# EAGLE design Crutch_Light_v1p01 (EAGLE 9.6.2)
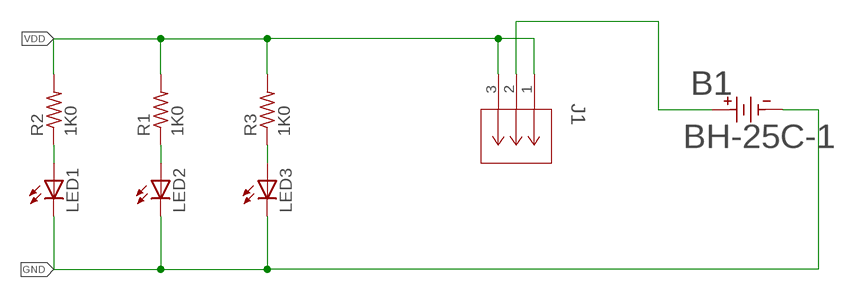
[diagram p0: schematic, sheet 1]

## Parts
B1  BH-25C-1  [BH-25C-1_ADM]
J1  CONN_530470310_PICOBLADE_X_3  [CON_530470310_MOL]
LED1  Green  LED_0805_GREEN  [0805]
LED2  Green  LED_0805_GREEN  [0805]
LED3  Green  LED_0805_GREEN  [0805]
R1  1K0  R_0402_1K0  [0402]
R2  1K0  R_0402_1K0  [0402]
R3  1K0  R_0402_1K0  [0402]

## Nets
GND: B1.1 LED1.2(C) LED2.2(C) LED3.2(C)
N$1: LED1.1(A) R2.P$1
N$2: LED2.1(A) R1.P$1
N$3: LED3.1(A) R3.P$1
N$4: B1.2 J1.2
VDD: J1.1 J1.3 R1.P$2 R2.P$2 R3.P$2

## Library data of the parts
B1 = 3D_MIG_Controller:BH-25C-1; COPYRIGHT: Copyright (C) 2023 Ultra Librarian. All rights reserved.; DIGIKEY_PART_NUMBER_1: 2057-BH-25C-1-ND; MANUFACTURER_PART_NUMBER: BH-25C-1; MFR_NAME: ADAM TECHNOLOGIES INC
J1 = 3D_MIG_Controller:CONN_530470310_PICOBLADE_X_3; COPYRIGHT: Copyright (C) 2022 Ultra Librarian. All rights reserved.; MFR_NAME: Molex Connector Corporation; PARTNO: 530470310
LED1-LED3 = 3D_MIG_Controller:LED_0805_GREEN: Green 570nm LED Indication - Discrete 2.2V 0805 (2012 Metric); PARTNO: LG R971-KN-1
R1-R3 = 3D_MIG_Controller:R_0402_1K0; PARTNO: CRG0402J1K0

## Board
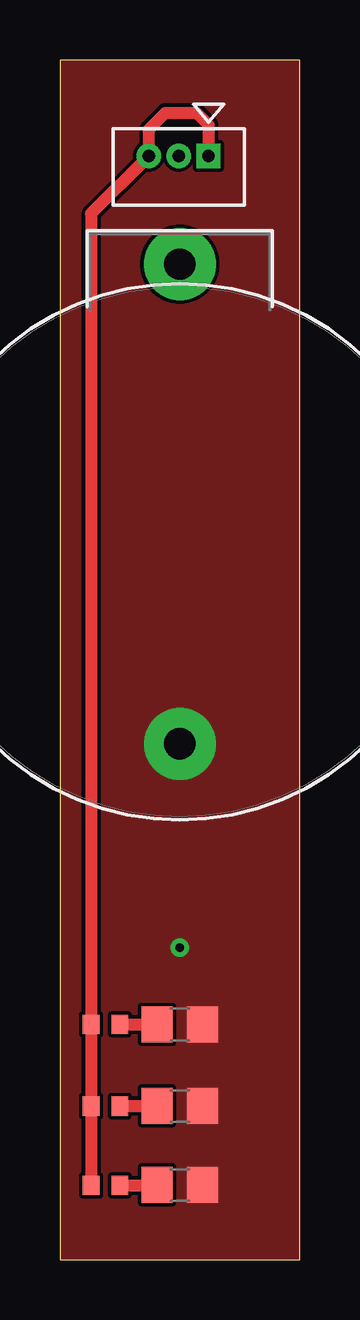
[diagram p1: board, top side]
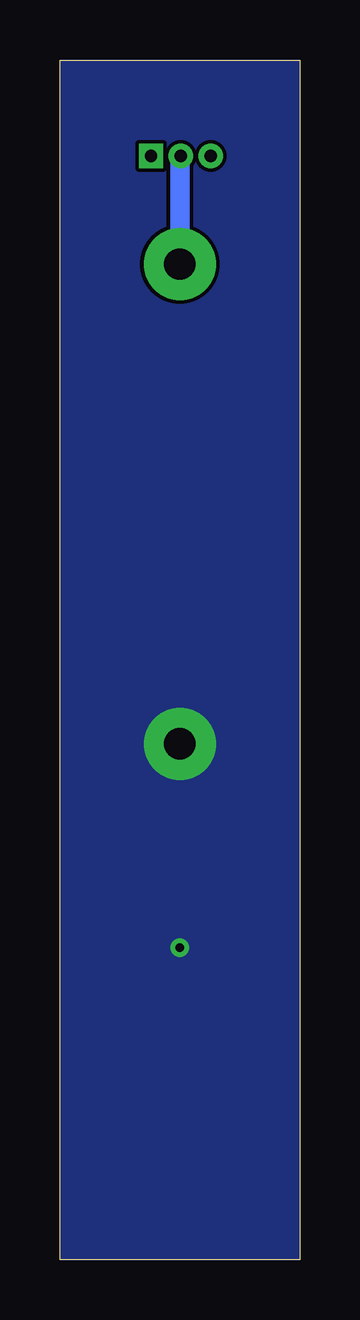
[diagram p2: board, bottom side, seen from below]

Size 10 x 50 mm. Coordinates in mm from the lower left corner, seen from the top.
Outline: 0,0 10,0 10,50 0,50 0,0
Copper layers (1*16): Top 0.035mm / dielectric 1.5mm / Bottom 0.035mm
Design rules "default *": minimum track width 6mil, minimum drill 0.35mm, track to track 6mil, track to pad 6mil, pad to pad 6mil, via to via 6mil, smd to smd 6mil, copper to edge 0mil, drill to drill 6mil, minimum pad ring 10mil, minimum via ring 8mil, stop-mask expansion 4mil, vias tented up to drill 0mil, thermal gap 10mil

### Footprints (pad centres in the part's own frame; a part is rotated, then mirrored left to right if it is on the bottom)
BH-25C-1_ADM = drill 1.295 pad 3: 1 0,0; 2 0,-19.99
CON_530470310_MOL = drill 0.508 pad 0.838 square: 1 0,0 | drill 0.508 pad 0.838: 2 -1.245,0; 3 -2.489,0
0805 = smd 1.3 x 1.5: 1 -0.95,0; 2 0.95,0
0402 = smd 0.8 x 0.7: P$1 0,0.6; P$2 0,-0.6

### Placement (x,y rotation side)
B1  5,21.5 180 top
J1  6.2,46 0 top
LED1  5,3.11 0 top
LED2  5,6.4 0 top
LED3  5,9.8 0 top
R1  1.9,6.4 270 top
R2  1.9,3.1 270 top
R3  1.9,9.8 270 top

### Tracks (layer width: path | path; a pad name or v marks a point on that pad's centre or on a via)
GND  (via drill 0.35)
  other vias: 5,13
  pour Top (no thermals): 0,50 10,50 10,0 0,0
  pour Bottom (no thermals): 0,0 0,50 10,50 10,0
N$1
  Top 0.508: R2.P$1 LED1.1
N$2
  Top 0.508: R1.P$1 LED2.1
N$3
  Top 0.508: R3.P$1 LED3.1
N$4
  Bottom 0.813: B1.2 5,45.95 J1.2
VDD
  Top 0.508: R2.P$2 R1.P$2 R3.P$2 1.3,43.59 J1.3 3.71,47.11 4.4,47.8 5.7,47.8 6.2,47.3 J1.1